# EAGLE design Power_Supply (EAGLE 9.5.1)

## Sheet 1 of 2: Power supply -5v,5V, 12V.
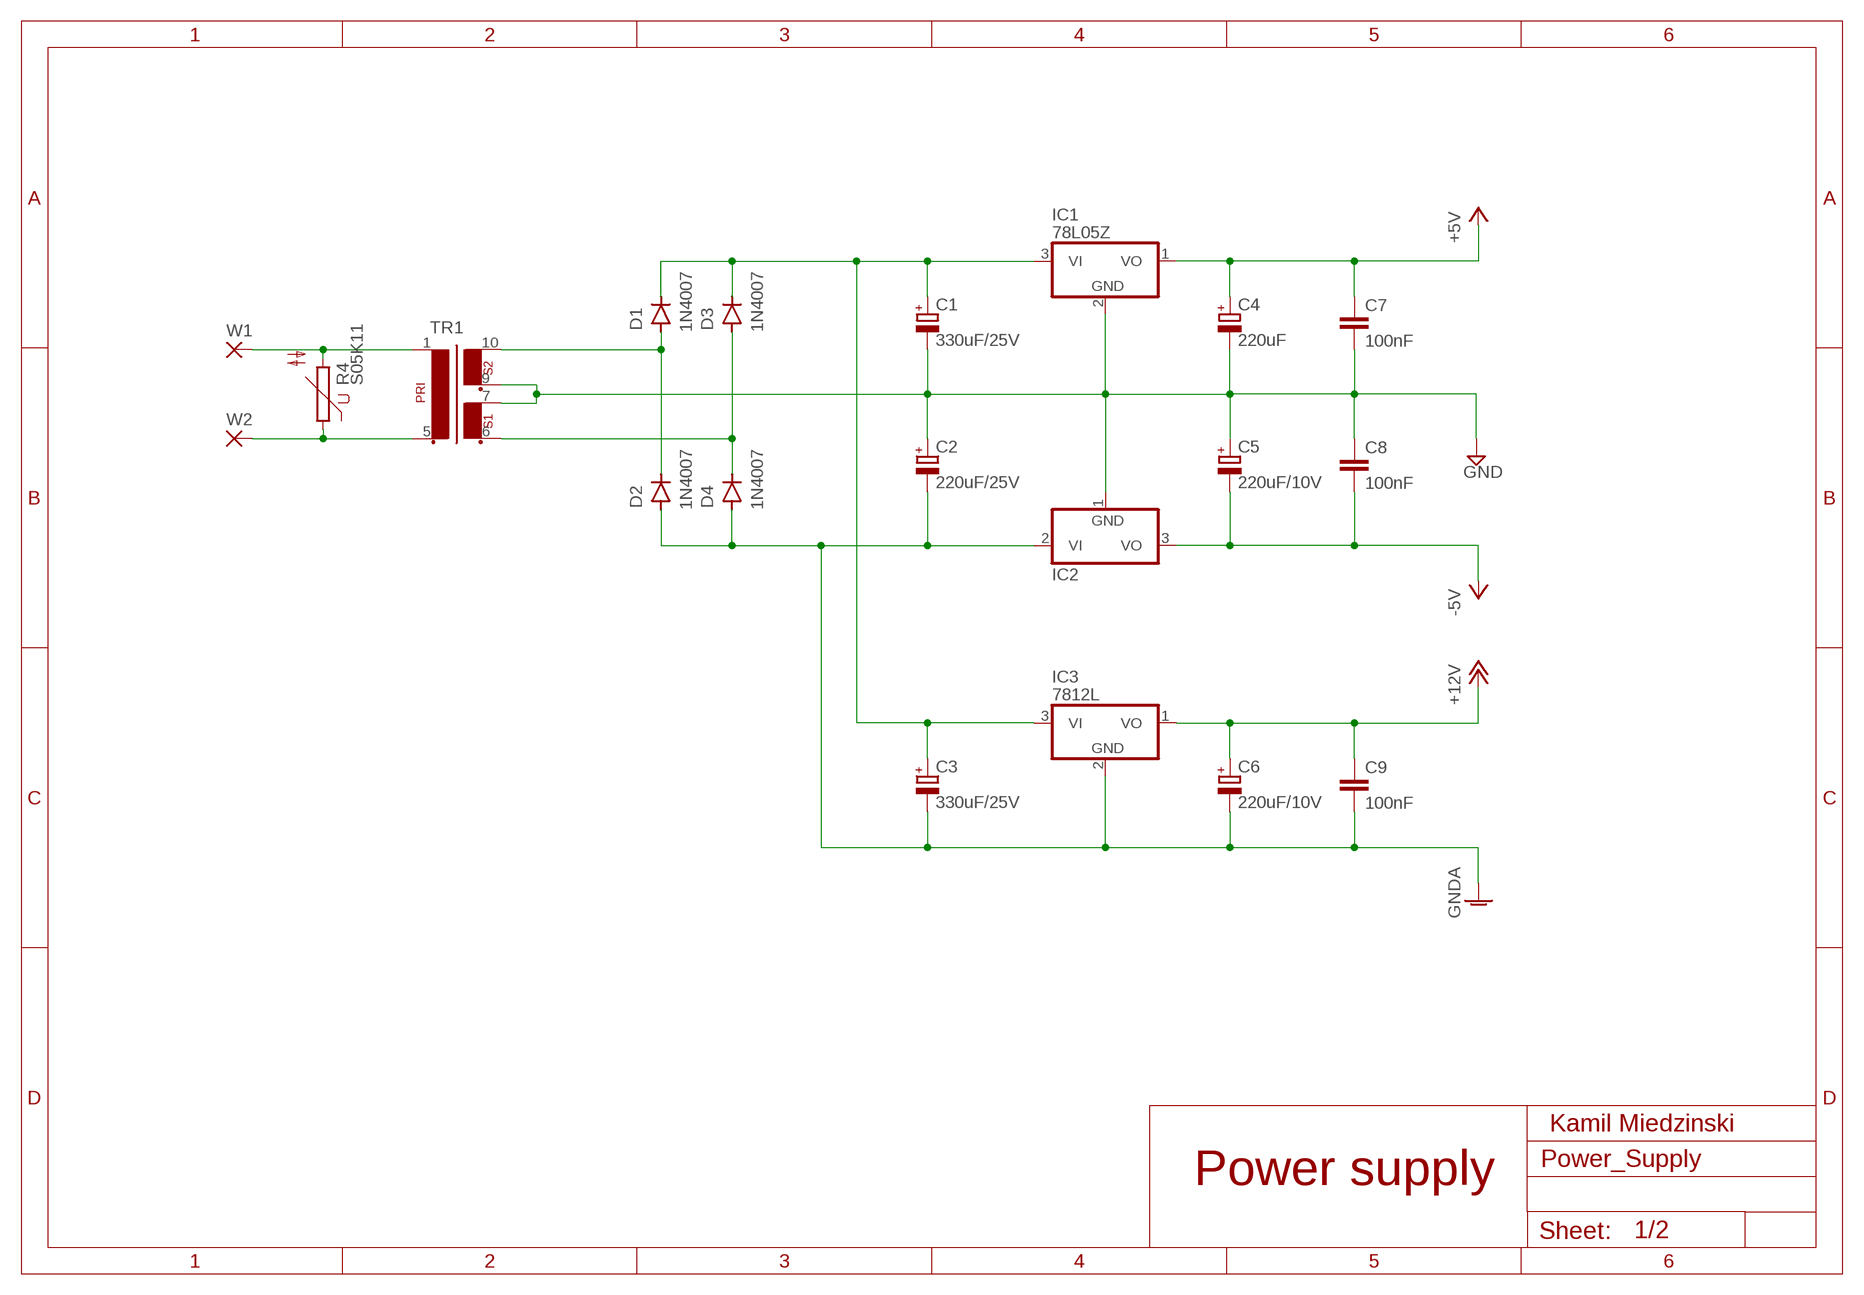
[diagram p0: schematic, sheet 1]

### Parts
C1  330uF/25V  CPOL-EUE3.5-8  [E3,5-8]
C2  220uF/25V  CPOL-EUE2.5-5  [E2,5-5]
C3  330uF/25V  CPOL-EUE3.5-8  [E3,5-8]
C4  220uF  CPOL-EUE2-4  [E2-4]
C5  220uF/10V  CPOL-EUE2-4  [E2-4]
C6  220uF/10V  CPOL-EUE2-4  [E2-4]
C7  100nF  C-EU025-024X044  [C025-024X044]
C8  100nF  C-EU025-024X044  [C025-024X044]
C9  100nF  C-EU025-024X044  [C025-024X044]
D1  1N4007  [DO-41]
D2  1N4007  [DO-41]
D3  1N4007  [DO-41]
D4  1N4007  [DO-41]
IC1  78L05Z  [TO92]
IC2  79L05Z  [TO92]
IC3  7812L  [TO92]
R4  S05K11  [S05K11]
TR1  TEZ_2.0VA/230V/2X9V  [TEZ_2.0VA/230V/2X9V]
W1  PAD_4/7  [4/7]
W2  PAD_4/7  [4/7]

### Nets
+5V: C4.+ C7.1 IC1.1(VO) ; also sheet 2
+12V: C6.+ C9.1 IC3.1(VO) ; also sheet 2
-5V: C5.- C8.2 IC2.3(VO) ; also sheet 2
GND: C1.- C2.+ C4.- C5.+ C7.2 C8.1 IC1.2(GND) IC2.1(GND) TR1.7 TR1.9 ; also sheet 2
GNDA: C2.- C3.- C6.- C9.2 D2.A D4.A IC2.2(VI) IC3.2(GND) ; also sheet 2
N$1: R4.2 TR1.1 W1.1(P)
N$2: R4.1 TR1.5 W2.1(P)
N$3: C1.+ C3.+ D1.C D3.C IC1.3(VI) IC3.3(VI)
N$5: D1.A D2.C TR1.10
N$6: D3.A D4.C TR1.6

### Notes on the sheet
- Kamil Miedzinski
- Power supply

## Sheet 2 of 2: Relay, conector to other board.
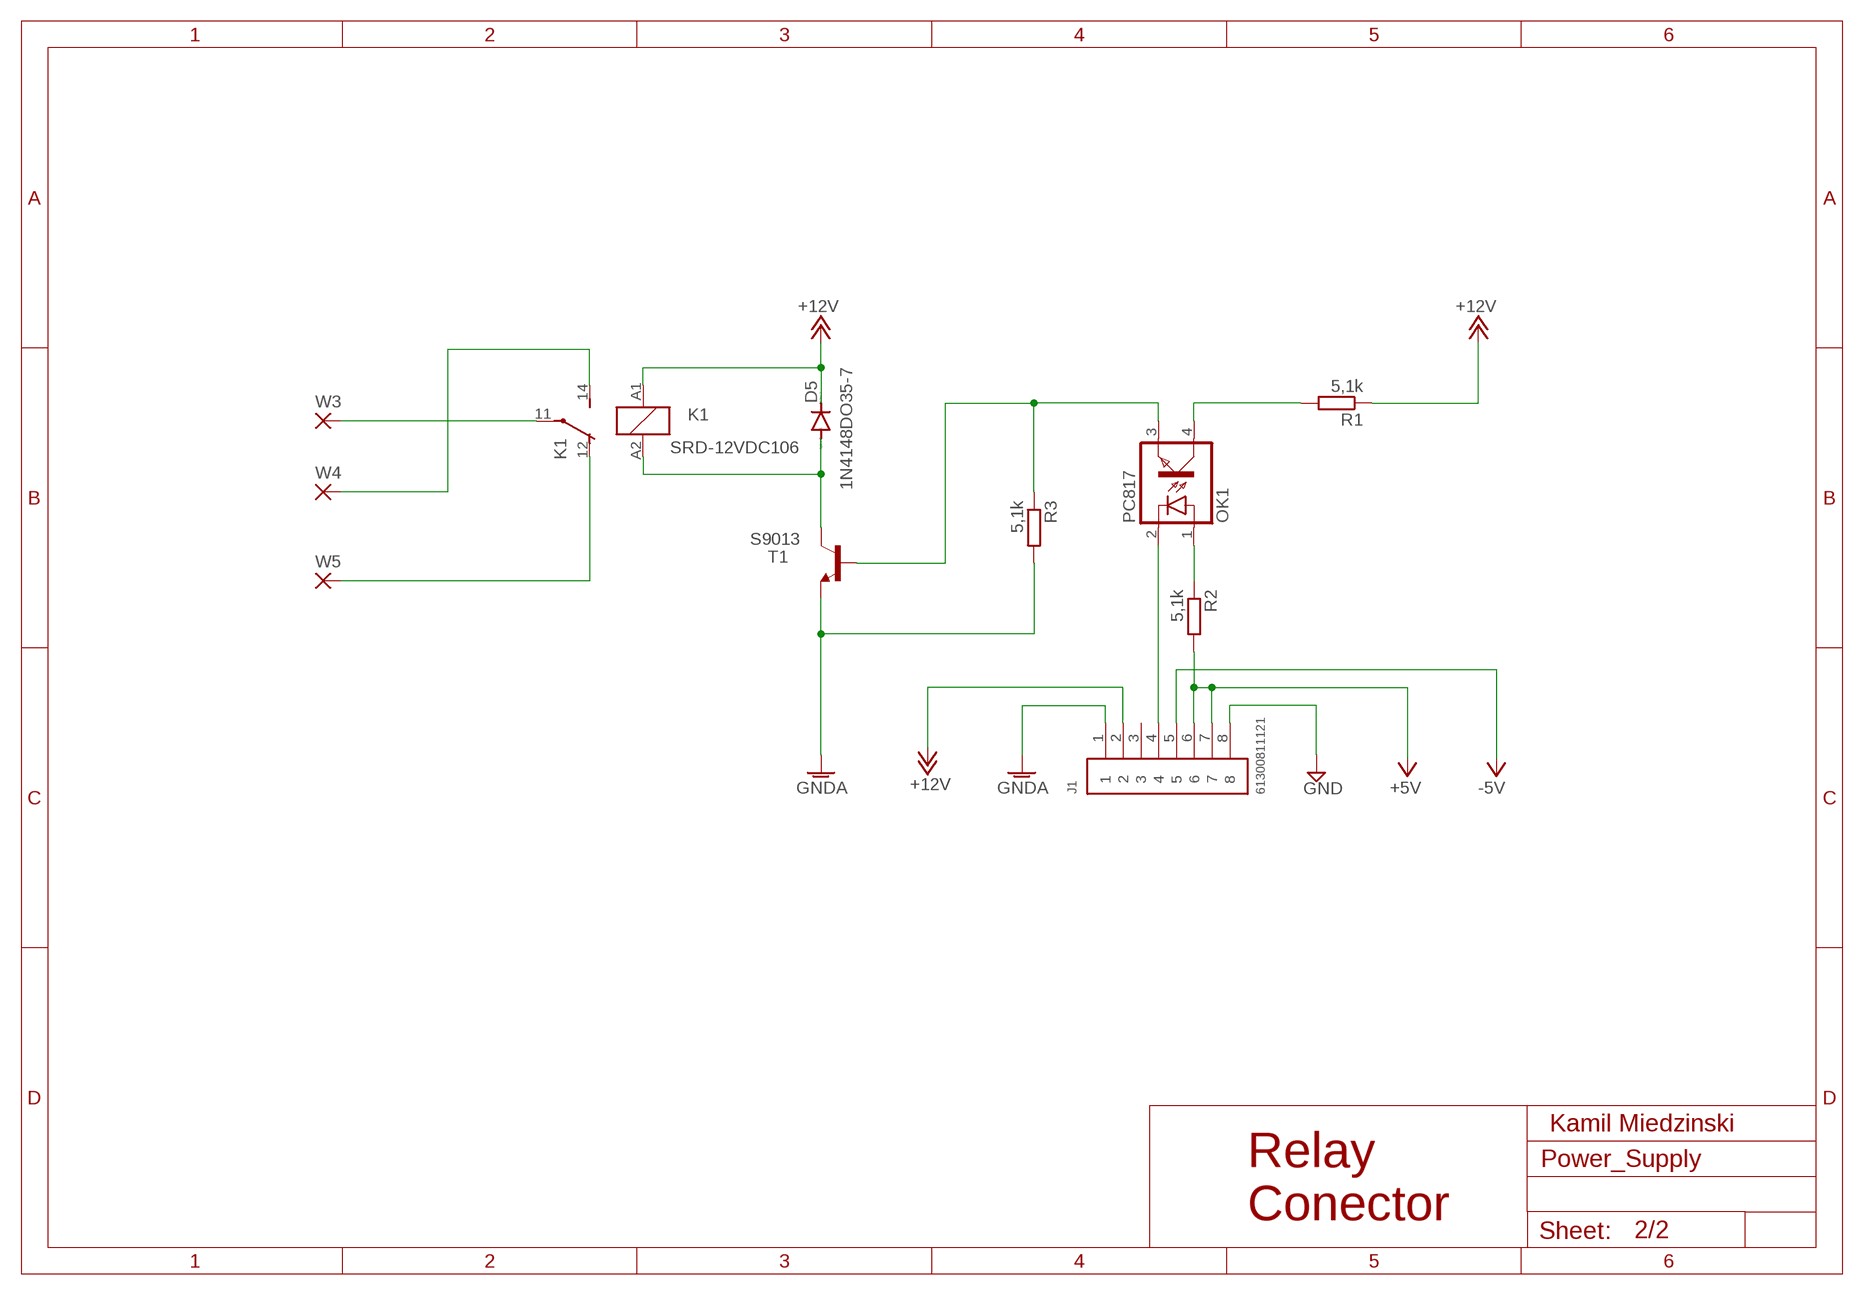
[diagram p1: schematic, sheet 2]

### Parts
D5  1N4148DO35-7  [DO35-7]
J1  61300811121  [61300811121]
K1  SRD-12VDC106  [ZN5]
OK1  PC817  [DIL04]
R1  5,1k  R-EU_0204/7  [0204/7]
R2  5,1k  R-EU_0204/7  [0204/7]
R3  5,1k  R-EU_0204/7  [0204/7]
T1  S9013  BC547  [TO92]
W3  PAD_4/7  [4/7]
W4  PAD_4/7  [4/7]
W5  PAD_4/7  [4/7]

### Nets
+5V: J1.6 J1.7 R2.2 ; also sheet 1
+12V: D5.C J1.2 K1.A1 R1.1 ; also sheet 1
-5V: J1.5 ; also sheet 1
GND: J1.8 ; also sheet 1
GNDA: J1.1 R3.2 T1.1(E) ; also sheet 1
N$4: K1.11(2:P) W3.1(P)
N$8: K1.12(2:O) W5.1(P)
N$9: K1.14(2:S) W4.1(P)
N$10: OK1.1(A) R2.1
N$11: J1.4 OK1.2(C)
N$14: OK1.3(EMIT) R3.1 T1.2(B)
N$15: D5.A K1.A2 T1.3(C)
N$16: OK1.4(COL) R1.2
Unconnected: J1.3

### Notes on the sheet
- Kamil Miedzinski
- Relay 
  Conector

## Library data of the parts
C1-C6 = rcl:CPOL-EU: POLARIZED CAPACITOR, European symbol; SPICEPREFIX: C
C7-C9 = rcl:C-EU: CAPACITOR, European symbol; SPICEPREFIX: C
D1-D4 = Diodes:1N4007: DIODE GEN PURP 1KV 1A DO41 Manufacturer's datasheet <https://www.mccsemi.com/pdf/Products/1N4001-1N4007(DO-41).pdf>; CREATED_BY: PCBLayout.com; DIGIKEY_PART_NUMBER: 1N4007MSCT-ND; MANUFACTURER: Micro Commercial Co; MPN: 1N4007; PACKAGE: DO-41
D5 = diode:1N4148: DIODE high speed (Philips)
IC1 IC3 = linear:78*: Positive VOLTAGE REGULATOR Source: http://cache.national.com/ds/LM/LM78L05.pdf http://www.fairchildsemi.com/ds/LM/LM7805.pdf
IC2 = linear:79*: Negative VOLTAGE REGULATOR
J1 = Headers:61300811121: CONN HEADER VERT 8POS 2.54MM Manufacturer's datasheet <https://katalog.we-online.de/em/datasheet/6130xx11121.pdf>; CREATED_BY: PCBLayout.com; DIGI_KEY_PART_NUMBER: 732-5321-ND; MANUFACTURER: Wurth Electronics Inc.; MPN: 61300811121
K1 = relay:SRD-12VDC: Miniature Power PCB Relay SCHRACK 1pole 10 A Source: http://www.schrack.com/.. 5847.pdf; OC_FARNELL: unknown; OC_NEWARK: unknown
OK1 = optocoupler:PC817: SHARP OPTO COUPLER; MPN: PC817X4J000F; OC_FARNELL: 9707727; OC_NEWARK: 97K7059
R1-R3 = rcl:R-EU_: RESISTOR, European symbol; SPICEPREFIX: R
R4 = varistor:S05K11: VARISTOR
T1 = transistor:BC547: NPN TRANSISTOR
TR1 = trafo:TEZ_2.0VA/230V/2X9V: TRANSFORMER 1 primary winding, 2 secondary windings BLOCK
W1-W5 = wirepad:PAD_4/7

## Board
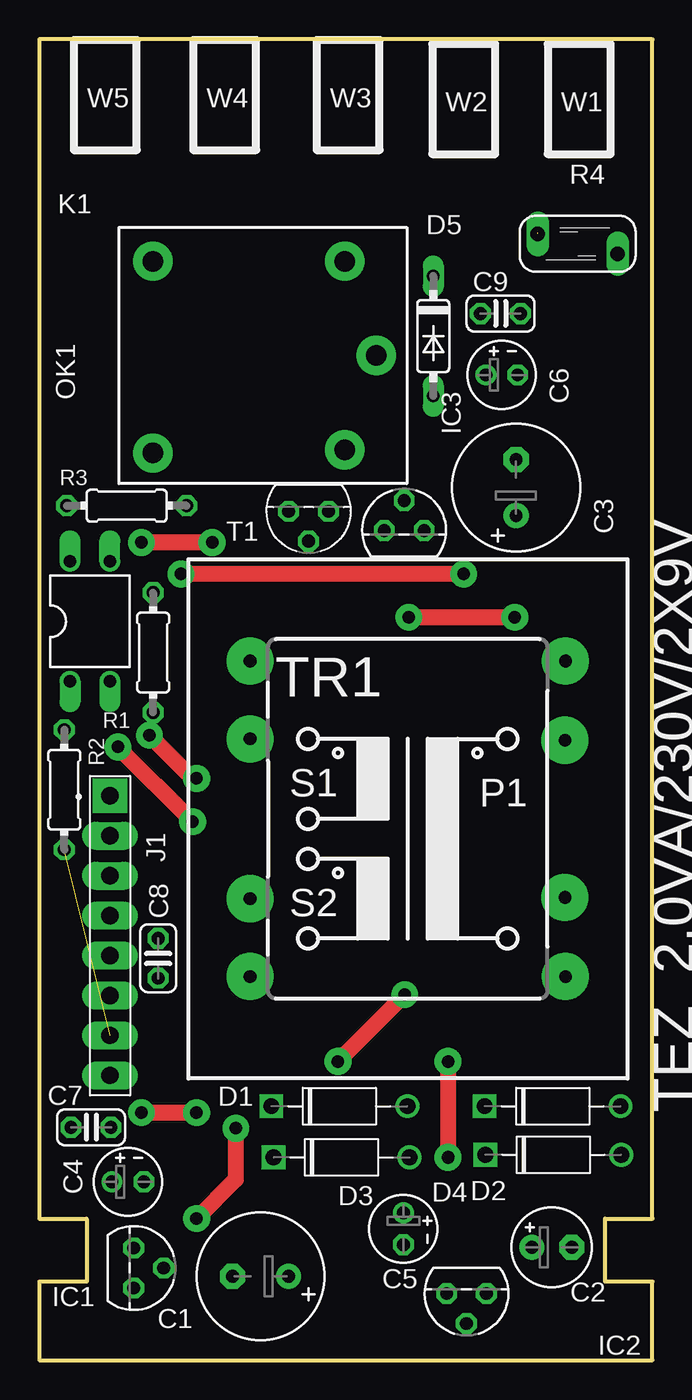
[diagram p2: board, top side]
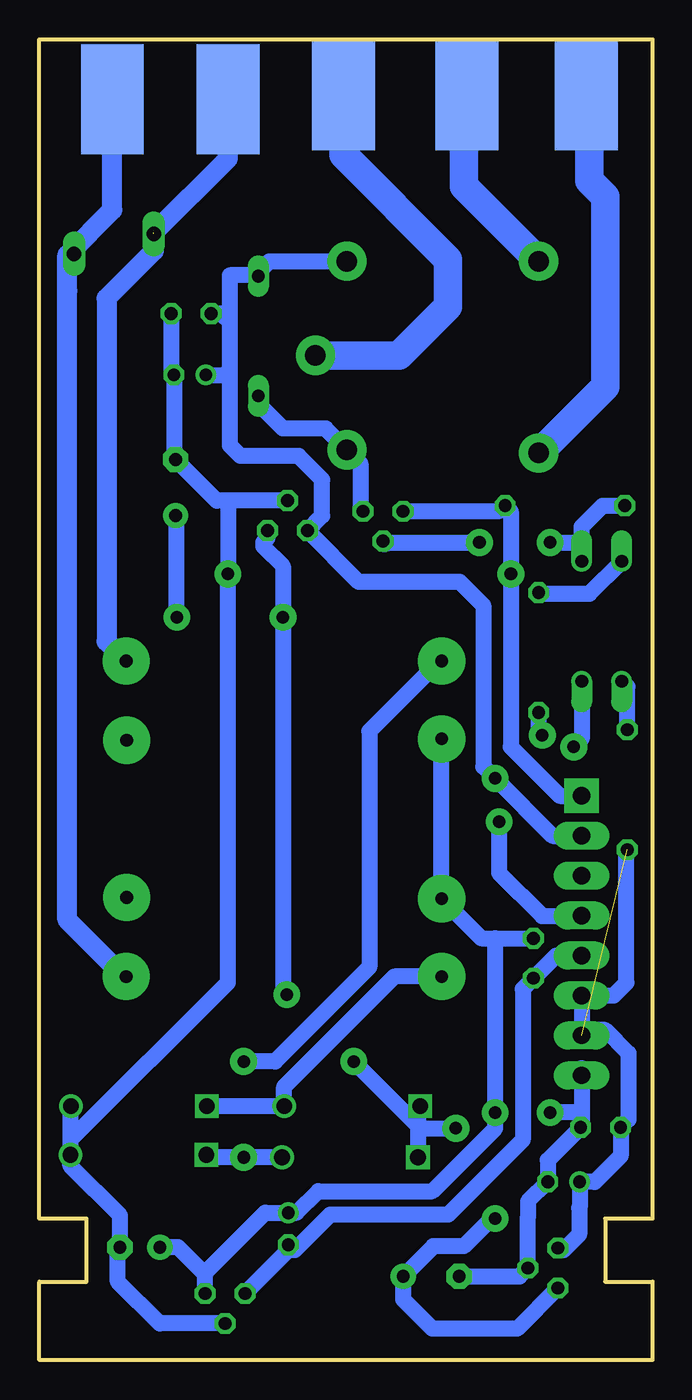
[diagram p3: board, bottom side, seen from below]

Size 39 x 84 mm. Coordinates in mm from the lower left corner, seen from the top.
Outline: 0,0 39,0 39,5 36,5 36,9 39,9 39,84 0,84 0,9 3,9 3,5 0,5 0,0
Copper layers (1*16): Top 0.035mm / dielectric 1.5mm / Bottom 0.035mm
Design rules "default": minimum track width 6mil, minimum drill 0.35mm, track to track 6mil, track to pad 6mil, pad to pad 6mil, via to via 6mil, smd to smd 6mil, copper to edge 40mil, drill to drill 6mil, minimum pad ring 10mil, minimum via ring 8mil, stop-mask expansion 4mil, vias tented up to drill 0mil, thermal gap 10mil

### Footprints (pad centres in the part's own frame; a part is rotated, then mirrored left to right if it is on the bottom)
E3,5-8 = drill 0.813 pad 1.6: + -1.778,0 | drill 0.813 pad 1.6 octagon: - 1.778,0
E2,5-5 = drill 0.813 pad 1.6: + -1.27,0 | drill 0.813 pad 1.6 octagon: - 1.27,0
E2-4 = drill 0.813 pad 1.27: + -1.016,0 | drill 0.813 pad 1.27 octagon: - 1.016,0
C025-024X044 = drill 0.813 octagon: 1 -1.27,0; 2 1.27,0
DO-41 = drill 1: A 4.325,0 | drill 1 square: C -4.325,0
DO35-7 = drill 0.813 long: A 3.81,0; C -3.81,0
TO92 = drill 0.813 octagon: 1 -1.27,0; 2 0,1.905; 3 1.27,0
61300811121 = drill 1.1 pad 2.184 square: 1 -8.89,0 | drill 1.1 pad 1.778 long: 2 -6.35,0; 3 -3.81,0; 4 -1.27,0; 5 1.27,0; 6 3.81,0; 7 6.35,0; 8 8.89,0
ZN5 = drill 1.3 pad 2.5: 11 8.89,0; 12 -5.31,-6.2; 14 -5.31,6; A1 6.89,6; A2 6.89,-6
DIL04 = drill 0.813 offset: 1 -1.27,-3.81; 2 1.27,-3.81; 3 1.27,3.81; 4 -1.27,3.81
0204/7 = drill 0.813 octagon: 1 -3.81,0; 2 3.81,0
S05K11 = drill 0.914 long: 1 -0.635,-2.54; 2 0.635,2.54
TO92' = drill 0.813 octagon: 1 1.27,0; 2 0,1.905; 3 -1.27,0
TEZ_2.0VA/230V/2X9V = drill 0.8 pad 3: 1 -10.033,10.033; 2 -10,5; 4 -10,-5; 5 -10.033,-10.033; 6 10.033,-10.033; 7 10.033,-5.08; 9 10.033,5.08; 10 10.033,10.033
4/7 = smd 4 x 7 bottom: 1 0,0

### Placement (x,y rotation side)
C1  14.07,5.33 180 top
C2  32.6,7.18 0 top
C3  30.33,55.5 90 top
C4  5.64,11.34 0 top
C5  23.16,8.36 270 top
C6  29.42,62.66 0 top
C7  3.29,14.81 0 top
C8  7.56,25.56 270 top
C9  29.34,66.56 0 top
D1  19.09,16.15 0 top
D2  32.66,16.15 0 top
D3  19.23,12.9 0 top
D4  32.7,13.06 0 top
D5  25.06,65.13 270 top
IC1  6.01,5.86 270 top
IC2  27.18,4.24 180 top
IC3  23.21,52.76 0 top
J1  4.5,27 270 top
K1  12.54,63.89 0 top
OK1  3.22,46.99 0 top
R1  7.24,45 90 top
R2  1.59,36.28 270 top
R3  5.56,54.34 0 top
R4  34.25,71 270 top
T1  S9013  [TO92']  17.13,53.99 180 top
TR1  23.44,34.43 180 top
W1  34.35,80.2 0 top
W2  27,80.2 0 top
W3  19.65,80.45 0 top
W4  11.8,80.45 0 top
W5  4.2,80.45 0 top

### Tracks (layer width: path | path; a pad name or v marks a point on that pad's centre or on a via)
+5V  (1 unrouted)
  Bottom 1.016: 1.65,32.47 1.65,24 2.46,23.19 J1.6 J1.7 4.15,21 3,21 1.52,19.52 1.52,15.31 C7.1 2.02,12.98 3.66,11.34 C4.+ 4.62,9.71 4.65,9.68 4.65,8 5.64,7.01 IC1.1
+12V  (via drill 0.8 pad 1.7)
  Top 1.016: v7,39.75 9.75,37 v10,37
  Bottom 1.016: K1.A1 24.36,69.89 25.06,69.19 D5.C 25.12,69 26.88,69 26.88,66 | 26.88,63 26.88,58.17 26.2,57.5 22.5,57.5 21,56 21,53.7 IC3.1 18.68,49.5 12.25,49.5 10.75,48 10.75,37.75 v10,37 6.35,33.35 J1.2 | 26.88,63 26.88,66 | C6.+ 27.21,62.66 26.88,63 | C9.1 27.43,66.56 26.88,66 | R1.1 7.24,40.26 7.25,40.25 7.25,39.75 v7,39.75
-5V
  Bottom 1.016: J1.5 6.12,25.73 C8.2 8.25,23.6 8.25,14 13,9.25 20.5,9.25 22.76,6.99 23.16,6.99 | IC2.3 23.16,6.99 | 23.16,6.99 C5.-
GND  (via drill 0.8 pad 1.7)
  Top 1.016: v6.5,15.75 v10,15.75 10.25,15.75
  Bottom 1.016: 4.5,18.57 J1.8 4.5,16 | TR1.7 TR1.9 10.89,26.83 10,26.83 | 10,26.83 C8.1 | 4.5,16 4.5,14.87 C7.2 6.66,12.71 C4.- 7.91,10.09 7.91,9.15 7.92,9.12 IC1.2 8.45,5.33 C1.- | C2.+ 30.18,7.18 28.45,5.45 IC2.1 28.45,5.55 24.62,9.38 C5.+ 22.62,9.38 21.25,10.75 14,10.75 10,14.75 v10,15.75 10,26.83 | 4.5,16 4.75,15.75 v6.5,15.75
GNDA  (via drill 0.8 pad 1.7)
  Top 1.016: v27,50 v9,50
  Bottom 0.813: R3.2 9,53.97
  Bottom 1.016: T1.1 9.71,54 R3.2 | 9,53.97 v9,50 9,39 5.89,35.89 J1.1 | C9.2 30.61,62.83 C6.- 30.44,57.38 C3.- 27.72,54.66 27,54.66 | IC3.2 27,54.66 | 27,54.66 v27,50 27,24.02 37.02,14 | D2.A 37.02,16.11 37.02,14 | 37.02,14 D4.A 37.02,12.36 33.87,9.21 C2.- 34,7.05 34,5 31.34,2.33 IC2.2
N$1
  Bottom 1.016: 37.22,68 37.22,69.93 R4.2
  Bottom 1.27: 35,79.55 W1.1 34.35,73.15 37.22,70.28 37.22,68 37.22,28 33.62,24.4 TR1.1
N$2  (1 unrouted)
  Bottom 1.016: R4.1 31.71,70.54
  Bottom 1.27: TR1.5 34.72,45.71 34.72,67.53 31.71,70.54 | 31.71,71.71 27,76.42 W2.1
N$3  (via drill 0.8 pad 1.7)
  Top 1.016: v23.5,47.25 v30.25,47.25 | v23.25,23.25 v19,19 | v12.5,14.75 12.5,11.5 v10,9
  Bottom 1.016: C3.+ 30.12,53.51 30.25,53.38 v30.25,47.25 | D1.C 14.9,16.01 14.9,15 | 14.9,15 D3.C | IC3.3 24.48,52.27 24.75,52 24.75,51.75 23.5,50.5 v23.5,47.25 23.5,23.5 v23.25,23.25 | v19,19 15,15 14.9,15 | IC1.3 8.6,2 14,2 15.85,3.85 C1.+ 13.93,7.25 12,7.25 10.25,9 v10,9 | 14.9,15 14.65,14.75 v12.5,14.75
N$4
  Bottom 1.8: 19.5,80.3 W3.1 19.65,76.65 13,70 13,67 16.11,63.89 K1.11
N$5
  Bottom 1.016: D2.C D1.A 23.41,17.39 16.41,24.4 TR1.10
N$6  (via drill 0.8 pad 1.7)
  Top 1.016: v26,19 v26,12.9
  Bottom 1.016: D3.A v26,12.9 28.21,12.9 D4.C | TR1.6 13.54,44.46 18,40 18,25 24,19 v26,19
N$8
  Bottom 1.8: 4.69,79.69 5,80 4.55,80.45 W5.1 4,80.25 4,75 3,74 3,61.92 K1.12
N$9
  Bottom 1.8: K1.14 12,74.66 12,80.25 W4.1
N$10
  Bottom 1.016: R2.1 1.59,42.82 OK1.1
N$11  (via drill 0.8 pad 1.7)
  Top 1.016: v5,39 v9.75,34.25
  Bottom 1.016: OK1.2 4.49,39.51 v5,39 | v9.75,34.25 9.75,31 7,28.25 4.52,28.25 J1.4
N$14  (via drill 0.8 pad 1.7)
  Top 1.016: v11,52 v6.5,52
  Bottom 1.016: OK1.3 4.49,52 | 4.49,52 4.49,53.01 3.16,54.34 R3.1 | 17.05,52 v11,52 | v6.5,52 4.49,52
  Bottom 1.27: T1.2 17.05,52
N$15
  Bottom 1.016: 25.06,60.56 D5.A 25.06,60.81 23.5,59.25 20.79,59.25 K1.A2 18.57,57.03 18.57,54.16 T1.3
N$16
  Bottom 1.016: OK1.4 4,48.75 7.18,48.75 R1.2